# EAGLE design disp board V2 (EAGLE 7.3.0)
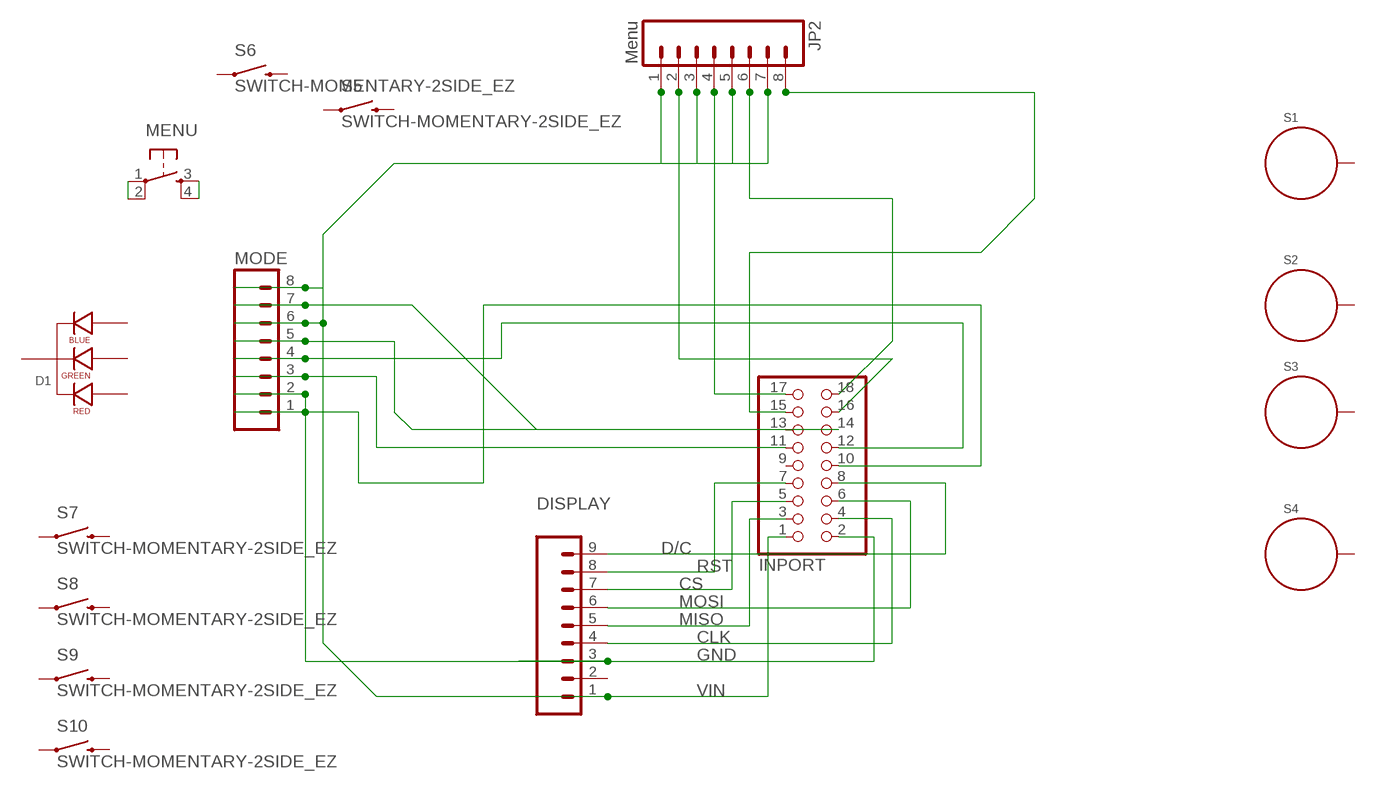
[diagram p0: schematic, sheet 1]

## Parts
D1  LED-RGB-CC-THRUCLEAR  [LED-RGB-THRU]
DISPLAY  M09  [1X09]
INPORT  PINHD-2X9-BIG  [2X09-BIG]
JP2  Menu  M08  [1X08_ROUND]
MENU  TAC_SWITCHPTH  [TACTILE-PTH]
MODE  M08  [1X08_ROUND]
S1  STANDOFF_ELECTRICAL  [STANDOFF-ELECTRICAL]
S2  STANDOFF_ELECTRICAL  [STANDOFF-ELECTRICAL]
S3  STANDOFF_ELECTRICAL  [STANDOFF-ELECTRICAL]
S4  STANDOFF_ELECTRICAL  [STANDOFF-ELECTRICAL]
S5  SWITCH-MOMENTARY-2SIDE_EZ  [TACTILE-PTH-SIDEEZ]
S6  SWITCH-MOMENTARY-2SIDE_EZ  [TACTILE-PTH-SIDEEZ]
S7  SWITCH-MOMENTARY-2SIDE_EZ  [TACTILE-PTH-SIDEEZ]
S8  SWITCH-MOMENTARY-2SIDE_EZ  [TACTILE-PTH-SIDEEZ]
S9  SWITCH-MOMENTARY-2SIDE_EZ  [TACTILE-PTH-SIDEEZ]
S10  SWITCH-MOMENTARY-2SIDE_EZ  [TACTILE-PTH-SIDEEZ]

## Nets
CLK: DISPLAY.4 INPORT.4
CS: DISPLAY.7 INPORT.5
D/C: DISPLAY.9 INPORT.8
GND: DISPLAY.3 INPORT.2 MODE.2
MISO: DISPLAY.5 INPORT.3
MOSI: DISPLAY.6 INPORT.6
N$1: INPORT.17 JP2.4
N$2: INPORT.16 JP2.2
N$3: MENU.1 MENU.2
N$4: INPORT.11 MODE.3
N$5: INPORT.13 MODE.5
N$6: INPORT.14 MODE.7
N$7: INPORT.12 MODE.4
N$8: INPORT.10 MODE.1
N$10: INPORT.18 JP2.6
N$11: INPORT.15 JP2.8
N$13: MENU.3 MENU.4
RST: DISPLAY.8 INPORT.7
VIN: DISPLAY.1 INPORT.1 JP2.1 JP2.3 JP2.5 JP2.7 MODE.6 MODE.8
Unconnected: D1.1(RED_CATHODE) D1.2(CATHODE) D1.3(GREEN_CATHODE) D1.4(BLUE_CATHODE) DISPLAY.2 INPORT.9 S1.P1 S2.P1 S3.P1 S4.P1 S5.1 S5.2 S6.1 S6.2 S7.1 S7.2 S8.1 S8.2 S9.1 S9.2 S10.1 S10.2

## Library data of the parts
D1 = SparkFun-LED:LED-RGB-CC-THRU: RGB Through-hole common cathode LED SparkFun Storefront: COM-00105 (Clear) COM-09264 (Diffuse); PROD_ID: DIO-08418
DISPLAY = SparkFun-Connectors:M09: Header 9 Standard 9-pin 0.1" header. Use with straight break away headers (SKU : PRT-00116), right angle break away headers (PRT-00553), swiss pins (PRT-00743), machine pins (PRT-00117), and female headers (PRT-00115).
INPORT = adafruit:PINHD-2X9: PIN HEADER With larger annulars
JP2 MODE = SparkFun-Connectors:M08: Header 8 Standard 8-pin 0.1" header. Use with straight break away headers (SKU : PRT-00116), right angle break away headers (PRT-00553), swiss pins (PRT-00743), machine pins (PRT-00117), and female headers (PRT-00115).
MENU = SparkFun-Retired:TAC_SWITCH: Momentary Switch Button commonly used for reset or general input. Spark Fun Electronics SKU : COM-00097 SMT- SWCH-08247
S1-S4 = SparkFun-Electromechanical:STANDOFF_ELECTRICAL: A standoff intended to be an electrically connected point. Pad size and stop size allow for a #4 Phillips pan screw head to make a solid connection to the board.
S5-S10 = SparkFun-Electromechanical:SWITCH-MOMENTARY-2: Various NO switches- pushbuttons, reed, etc

## Board
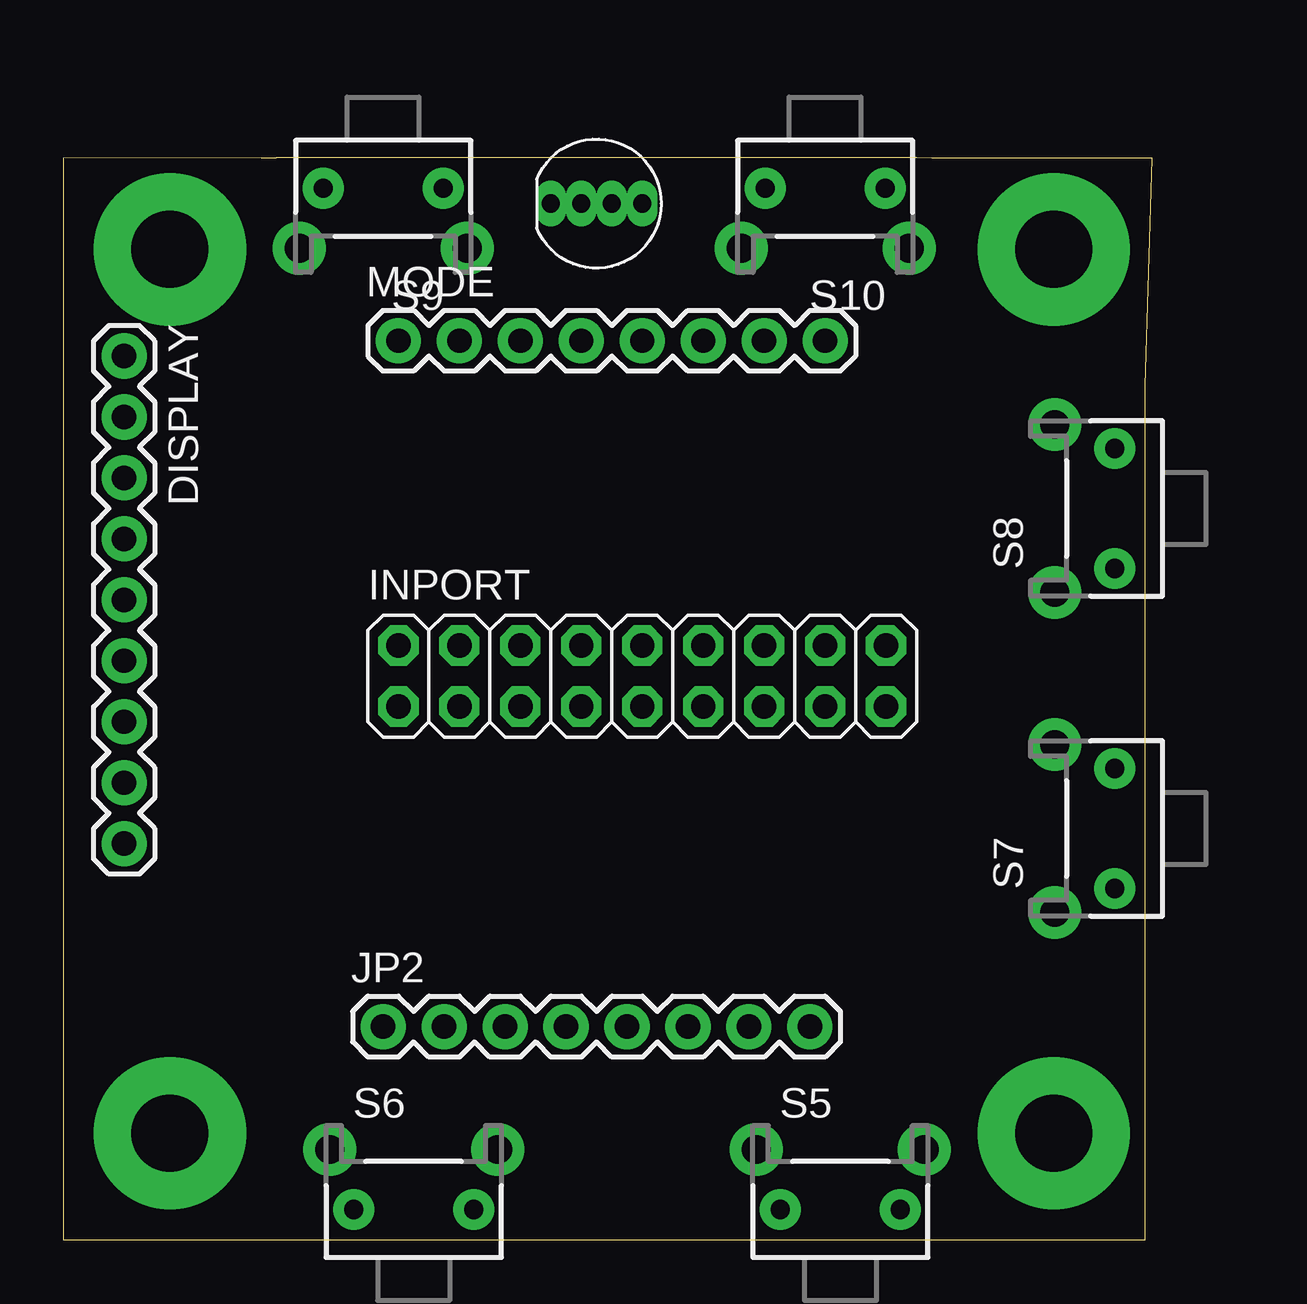
[diagram p1: board, top side]
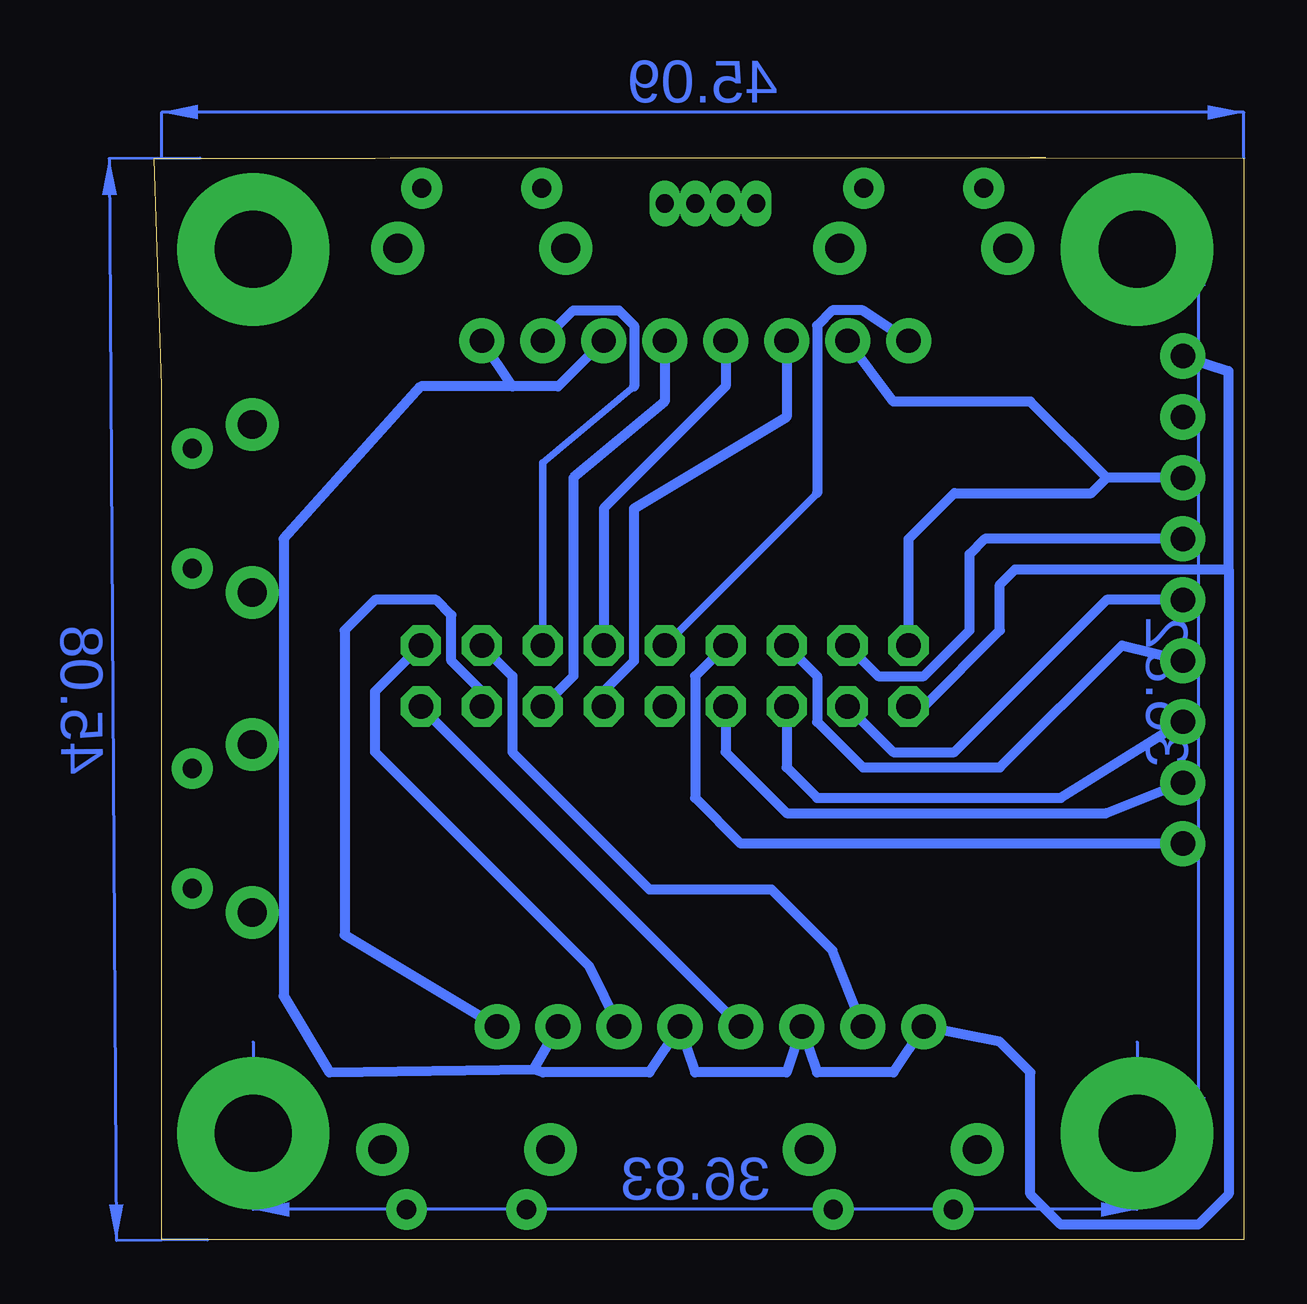
[diagram p2: board, bottom side, seen from below]

Size 45.39 x 45.09 mm. Coordinates in mm from the lower left corner, seen from the top.
Outline: 8.89,45.09 35.56,45.09 36.2,45.07 45.39,45.07 45.09,35.56 45.09,0 0,0 0,45.07 8.89,45.09
Outline: 8.25,45.09 8.89,45.09
Copper layers (1*16): Top 0.035mm / dielectric 1.5mm / Bottom 0.035mm
Design rules "Othermill-DRC-1-32": minimum track width 8mil, minimum drill 0.8mm, track to track 0.794003125mm, track to pad 0.794003125mm, pad to pad 0.794003125mm, via to via 0.794003125mm, smd to smd 0mil, copper to edge 0mil, drill to drill 1mil, minimum pad ring 10mil, minimum via ring 10mil, stop-mask expansion 1mil, vias tented up to drill 30mil, thermal gap 10mil

### Footprints (pad centres in the part's own frame; a part is rotated, then mirrored left to right if it is on the bottom)
LED-RGB-THRU = drill 0.762 pad 0.889 long: 1 1.905,0; 2 0.635,0; 3 -0.635,0; 4 -1.905,0
1X09 = drill 1.016 pad 1.88: 1 0,0; 2 2.54,0; 3 5.08,0; 4 7.62,0; 5 10.16,0; 6 12.7,0; 7 15.24,0; 8 17.78,0; 9 20.32,0
2X09-BIG = drill 1.016 pad 1.676 octagon: 1 -10.16,-1.27; 2 -10.16,1.27; 3 -7.62,-1.27; 4 -7.62,1.27; 5 -5.08,-1.27; 6 -5.08,1.27; 7 -2.54,-1.27; 8 -2.54,1.27; 9 0,-1.27; 10 0,1.27; 11 2.54,-1.27; 12 2.54,1.27; 13 5.08,-1.27; 14 5.08,1.27; 15 7.62,-1.27; 16 7.62,1.27; 17 10.16,-1.27; 18 10.16,1.27
1X08_ROUND = drill 1.016 pad 1.88: 1 0,0; 2 2.54,0; 3 5.08,0; 4 7.62,0; 5 10.16,0; 6 12.7,0; 7 15.24,0; 8 17.78,0
TACTILE-PTH = drill 1.016 pad 1.88: 1 -3.251,2.261; 2 3.251,2.261; 3 -3.251,-2.261; 4 3.251,-2.261
STANDOFF-ELECTRICAL = drill 3.2 pad 6.35: P1 0,0
TACTILE-PTH-SIDEEZ = drill 0.8 pad 1.7: 1 -2.5,0; 2 2.5,0 | drill 1.2 pad 2.2: ANCHOR1 -3.5,2.5; ANCHOR2 3.5,2.5

### Placement (x,y rotation side)
D1  22.23,43.18 180 top
DISPLAY  2.54,36.83 270 top
INPORT  24.13,23.5 0 top
JP2  13.34,8.89 0 top
MENU  69.22,41.27 90 top  (outside the outline)
MODE  13.97,37.47 0 top
S1  41.27,41.27 0 top
S2  4.45,41.27 0 top
S3  41.27,4.45 0 top
S4  4.45,4.45 0 top
S5  32.38,1.27 0 top
S6  14.61,1.27 0 top
S7  43.81,17.15 90 top
S8  43.81,30.48 90 top
S9  13.34,43.82 180 top
S10  31.75,43.82 180 top

### Tracks (layer width: path | path; a pad name or v marks a point on that pad's centre or on a via)
CLK
  Bottom 0.406: INPORT.4 15.24,23.5 13.34,23.5 11.43,25.4 11.43,28.58 10.8,29.21 DISPLAY.4
CS
  Bottom 0.406: INPORT.5 19.05,19.69 17.78,18.41 7.62,18.41 DISPLAY.7
D/C
  Bottom 0.406: INPORT.8 22.86,23.5 22.86,18.41 20.95,16.51 DISPLAY.9
GND
  Bottom 0.406: INPORT.2 13.97,29.21 12.07,31.12 6.35,31.12 5.71,31.75 | 5.71,31.75 8.89,34.93 14.61,34.93 MODE.2 | DISPLAY.3 5.71,31.75
MISO
  Bottom 0.406: INPORT.3 14.61,20.32 12.07,20.32 5.71,26.67 DISPLAY.5
MOSI
  Bottom 0.406: INPORT.6 17.78,23.5 17.78,21.59 15.88,19.69 10.16,19.69 5.08,24.77 DISPLAY.6
N$1
  Bottom 0.406: INPORT.17 JP2.4
N$2
  Bottom 0.406: INPORT.16 30.48,23.5 30.48,20.32 24.77,14.61 19.69,14.61 17.15,12.07 JP2.2
N$3  (1 unrouted)
N$4
  Bottom 0.406: INPORT.11 26.67,22.86 25.4,24.13 25.4,30.48 19.05,34.29 MODE.3
N$5
  Bottom 0.406: INPORT.13 27.94,23.5 27.94,31.75 24.13,34.93 MODE.5
N$6
  Bottom 0.305: 25.4,35.56 29.21,32.38 INPORT.14
  Bottom 0.406: MODE.7 27.94,38.74 26.03,38.74 25.4,38.1 25.4,35.56
N$7
  Bottom 0.406: INPORT.12 26.67,30.48 21.59,35.56 MODE.4
N$8
  Bottom 0.305: 17.78,31.12 INPORT.10
  Bottom 0.406: MODE.1 15.88,38.74 17.15,38.74 17.78,38.1 17.78,31.12
N$10
  Bottom 0.406: INPORT.18 36.2,22.86 36.2,20.32 27.3,11.43 JP2.6
N$11
  Bottom 0.406: INPORT.15 31.75,22.86 33.02,24.13 33.02,26.04 33.66,26.67 36.2,26.67 37.47,25.4 37.47,12.7 JP2.8
N$13  (1 unrouted)
RST
  Bottom 0.406: INPORT.7 21.59,20.32 19.05,17.78 5.71,17.78 DISPLAY.8
VIN
  Bottom 0.406: INPORT.1 13.34,22.23 10.16,25.4 10.16,27.3 9.52,27.94 0.64,27.94 | 0.64,27.94 0.64,36.2 DISPLAY.1 | 0.64,27.94 0.64,1.91 1.91,0.64 7.62,0.64 8.89,1.91 8.89,6.98 10.16,8.26 JP2.1 14.61,6.98 17.78,6.98 JP2.3 19.05,6.98 22.86,6.98 JP2.5 24.77,6.98 29.21,6.98 29.59,7.11 | 29.59,7.11 JP2.7 | 30.48,35.56 28.58,35.56 MODE.6 | 30.48,35.56 MODE.8 | 30.48,35.56 34.29,35.56 40.01,29.21 40.01,10.16 38.1,6.98 29.59,7.11
(copper drawn outside any net)
  shapes: Bottom area x4

### Text on the board
tTest: VIN | GND | GND | VIN